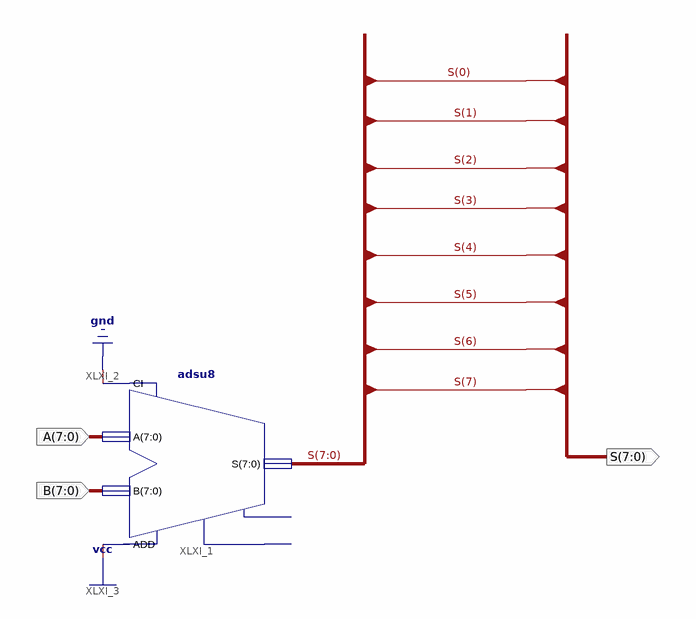
[diagram p0: schematic sheet 1]
// Xilinx ISE schematic Add8bits.sch (spartan6) as structural Verilog: 1 symbols, 3 ports
module Add8bits (
  input  [7:0] A,
  input  [7:0] B,
  output [7:0] S
);

  adsu8 XLXI_1 (.A(A), .ADD(1'b1), .B(B), .CI(1'b0), .S(S));  // open: CO, OFL
endmodule
